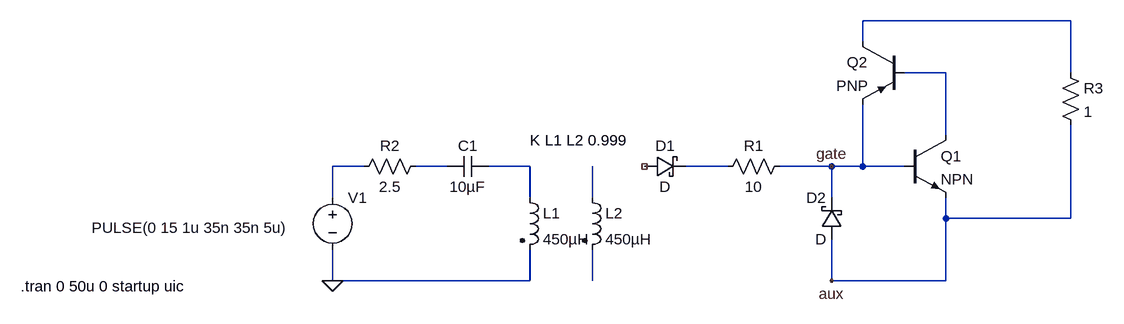
[diagram p0: schematic gate_driver.asc]
gate_driver.asc, the LTspice schematic file:
Version 4
SHEET 1 1256 680
WIRE 1200 -128 880 -128
WIRE 880 -96 880 -128
WIRE 1008 -48 944 -48
WIRE 1200 -48 1200 -128
WIRE 1008 48 1008 -48
WIRE 112 96 64 96
WIRE 240 96 192 96
WIRE 368 96 304 96
WIRE 672 96 608 96
WIRE 832 96 752 96
WIRE 880 96 880 0
WIRE 880 96 832 96
WIRE 944 96 880 96
WIRE 64 144 64 96
WIRE 368 144 368 96
WIRE 464 144 464 96
WIRE 832 144 832 96
WIRE 1008 176 1008 144
WIRE 1200 176 1200 32
WIRE 1200 176 1008 176
WIRE 64 272 64 224
WIRE 368 272 368 224
WIRE 368 272 64 272
WIRE 464 272 464 224
WIRE 832 272 832 208
WIRE 1008 272 1008 176
WIRE 1008 272 832 272
FLAG 64 272 0
FLAG 832 96 gate
FLAG 832 272 aux
SYMBOL voltage 64 128 R0
WINDOW 3 -371 62 Left 2
WINDOW 123 0 0 Left 0
WINDOW 39 0 0 Left 0
SYMATTR Value PULSE(0 15 1u 35n 35n 5u)
SYMATTR InstName V1
SYMBOL ind2 352 128 R0
SYMATTR InstName L1
SYMATTR Value 450µH
SYMATTR Type ind
SYMBOL ind2 448 128 R0
SYMATTR InstName L2
SYMATTR Value 450µH
SYMATTR Type ind
SYMBOL schottky 544 112 R270
WINDOW 0 32 32 VTop 2
WINDOW 3 0 32 VBottom 2
SYMATTR InstName D1
SYMBOL schottky 848 208 R180
WINDOW 0 24 64 Left 2
WINDOW 3 24 0 Left 2
SYMATTR InstName D2
SYMBOL res 768 80 R90
WINDOW 0 0 56 VBottom 2
WINDOW 3 32 56 VTop 2
SYMATTR InstName R1
SYMATTR Value 10
SYMBOL res 208 80 R90
WINDOW 0 0 56 VBottom 2
WINDOW 3 32 56 VTop 2
SYMATTR InstName R2
SYMATTR Value 2.5
SYMBOL npn 944 48 R0
SYMATTR InstName Q1
SYMBOL pnp 944 -96 M0
SYMATTR InstName Q2
SYMBOL res 1184 -64 R0
SYMATTR InstName R3
SYMATTR Value 1
SYMBOL cap 304 80 R90
WINDOW 0 0 32 VBottom 2
WINDOW 3 32 32 VTop 2
SYMATTR InstName C1
SYMATTR Value 10µF
TEXT -416 280 Left 2 !.tran 0 50u 0 startup uic
TEXT 368 56 Left 2 !K L1 L2 0.999

The netlist it stands for:
* gate_driver.asc
V1 N003 0 PULSE(0 15 1u 35n 35n 5u)
L1 N005 0 450µH
L2 N007 N008 450µH
D1 NC_01 N006 D
D2 aux gate D
R1 gate N006 10
R2 N004 N003 2.5
Q1 N002 gate aux 0 NPN
Q2 N001 N002 gate 0 PNP
R3 N001 aux 1
C1 N005 N004 10µF
.model D D
.lib standard.dio
.model NPN NPN
.model PNP PNP
.lib standard.bjt
.tran 0 50u 0 startup uic
K L1 L2 0.999
.backanno
.end